# EAGLE design CAN Traffic Teensy 3.2 rev1 (EAGLE 9.6.2)
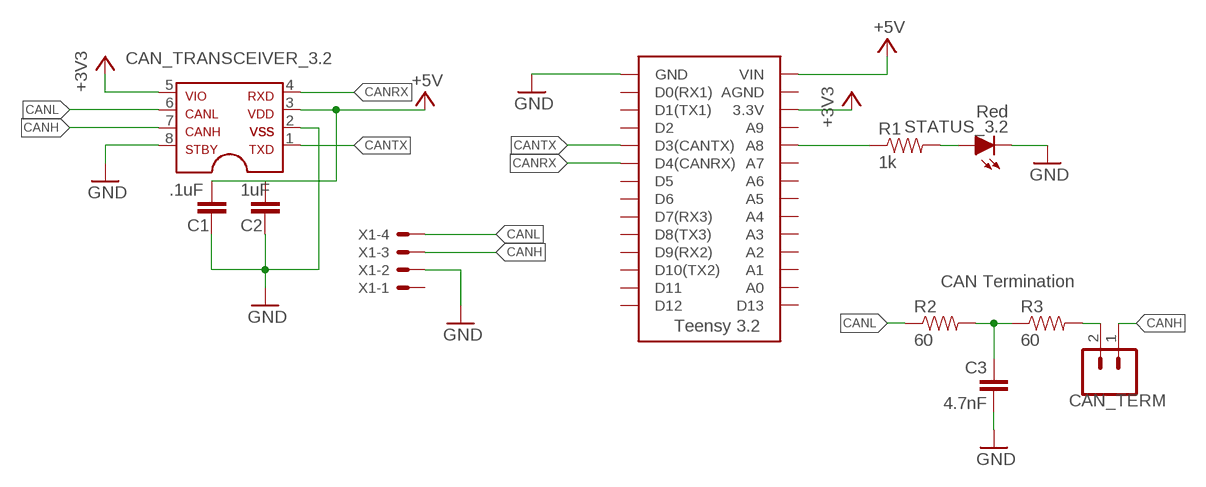
[diagram p0: schematic, sheet 1]

## Parts
3.2  TEENSY_3.2_SIMPLE  [TEENSY_3.2_SIMPLE]
C1  .1uF  CAP0603-CAP  [0603-CAP]
C2  1uF  CAP0603-CAP  [0603-CAP]
C3  4.7nF  CAP0603-CAP  [0603-CAP]
CAN_TERM  M02_SLIM  [1X02_SLIM]
CAN_TRANSCEIVER_3.2  MCP2562FDSOIC-08  [SOIC-08]
R1  1k  RESISTOR0603-RES  [0603-RES]
R2  60  RESISTOR0603-RES  [0603-RES]
R3  60  RESISTOR0603-RES  [0603-RES]
STATUS_3.2  Red  LED-0603  [LED-603]
X1  CONNECTOR-4NANO-FIT_RIGHT_ANGLE-4-SURFACE  [NANO-FIT_RIGHT_ANGLE-4-SURFACE]

## Nets
+3V3: 3.2.3.3V CAN_TRANSCEIVER_3.2.5
+5V: 3.2.VIN C1.1 C2.1 CAN_TRANSCEIVER_3.2.3
CANH: CAN_TERM.1 CAN_TRANSCEIVER_3.2.7 X1.3
CANL: CAN_TRANSCEIVER_3.2.6 R2.1 X1.4
CANRX: 3.2.D4(CANRX) CAN_TRANSCEIVER_3.2.4
CANTX: 3.2.D3(CANTX) CAN_TRANSCEIVER_3.2.1
GND: 3.2.GND C1.2 C2.2 C3.2 CAN_TRANSCEIVER_3.2.2 CAN_TRANSCEIVER_3.2.8 STATUS_3.2.C X1.2
N$2: C3.1 R2.2 R3.1
N$3: 3.2.A8 R1.1
N$4: R1.2 STATUS_3.2.A
N$5: CAN_TERM.2 R3.2
Unconnected: 3.2.A0 3.2.A1 3.2.A2 3.2.A3 3.2.A4 3.2.A5 3.2.A6 3.2.A7 3.2.A9 3.2.AGND 3.2.D0(RX1) 3.2.D1(TX1) 3.2.D2 3.2.D5 3.2.D6 3.2.D7(RX3) 3.2.D8(TX3) 3.2.D9(RX2) 3.2.D10(TX2) 3.2.D11 3.2.D12 3.2.D13 X1.1

## Notes on the sheet
- CAN Termination

## Library data of the parts
3.2 = HyTechDevices:TEENSY_3.2_SIMPLE: Simple version of the Teensy 3.2 board that only uses the 2 main rows of pins, not the inner pins or the pins opposite the usb port.
C1-C3 = HyTechDevices:CAP: Capacitor Standard 0603 ceramic capacitor, and 0.1" leaded capacitor.
CAN_TERM = HyTechDevices:M02: Standard 2-pin 0.1" header. NOTES ON THE VARIANTS LOCK and LOCK_LONGPADS... This footprint was designed to help hold the alignment of a through-hole component (i.e. 6-pin header) while soldering it into place. You may notice that each hole has been shifted either up or down by 0.005 of an inch from it's more standard position (which is a perfectly straight line). This slight alteration caused the pins (the squares in the middle) to touch the edges of the holes. Because they are alternating, it causes a "brace" to hold the component in place. 0.005 has proven to be the perfect amount of "off-center" position when using our standard breakaway headers. Although looks a little odd when you look at the bare footprint, once you have a header in there, the alteration is very hard to notice. Also,if you push a header all the way into place, it is covered up entirely on the bottom side. This idea of altering the position of holes to aid alignment will be further integrated into the Sparkfun Library for other footprints. It can help hold any component with 3 or more connection pins. Note: The Sparkfun version includes many other packages including surface mount that may be of future interest. Source: Sparkfun <https://github.com/sparkfun/SparkFun-Eagle-Libraries>
CAN_TRANSCEIVER_3.2 = HyTechDevices:MCP2562FD: MCP2562FD High-speed CAN Transceiver Datatsheet <http://ww1.microchip.com/downloads/en/devicedoc/20005167c.pdf>
R1-R3 = HyTechDevices:RESISTOR: Resistor Basic schematic elements and footprints for 0603, 1206, and PTH resistors.
STATUS_3.2 = HyTechDevices:LED: Light Emitting Diode (LED) Source: Dangerous Prototypes Eagle Library <https://github.com/DangerousPrototypes/Eagle_Part_Library>
X1 = HyTechDevices:CONNECTOR-4: Mini-Fit Junior connector 4 pole Source: http://www.molex.com

## Board
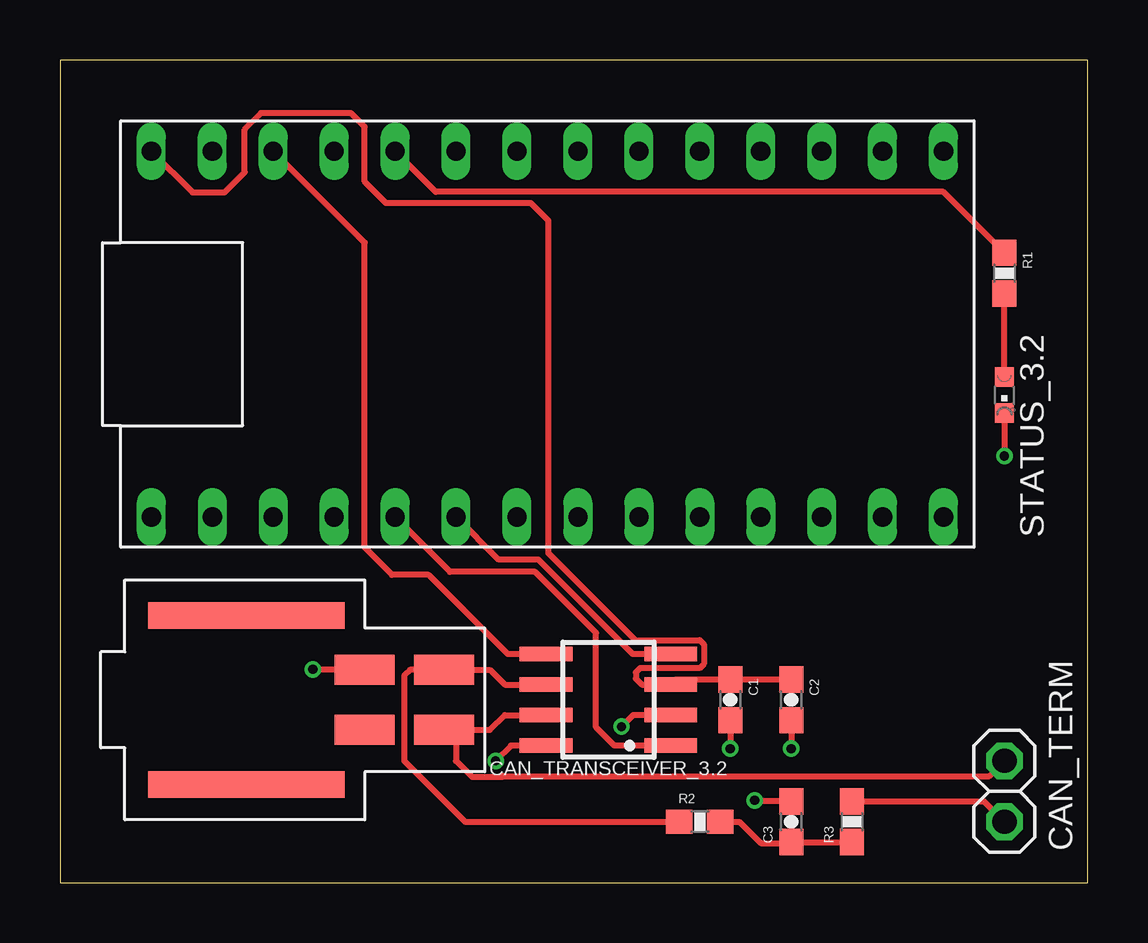
[diagram p1: board, top side]
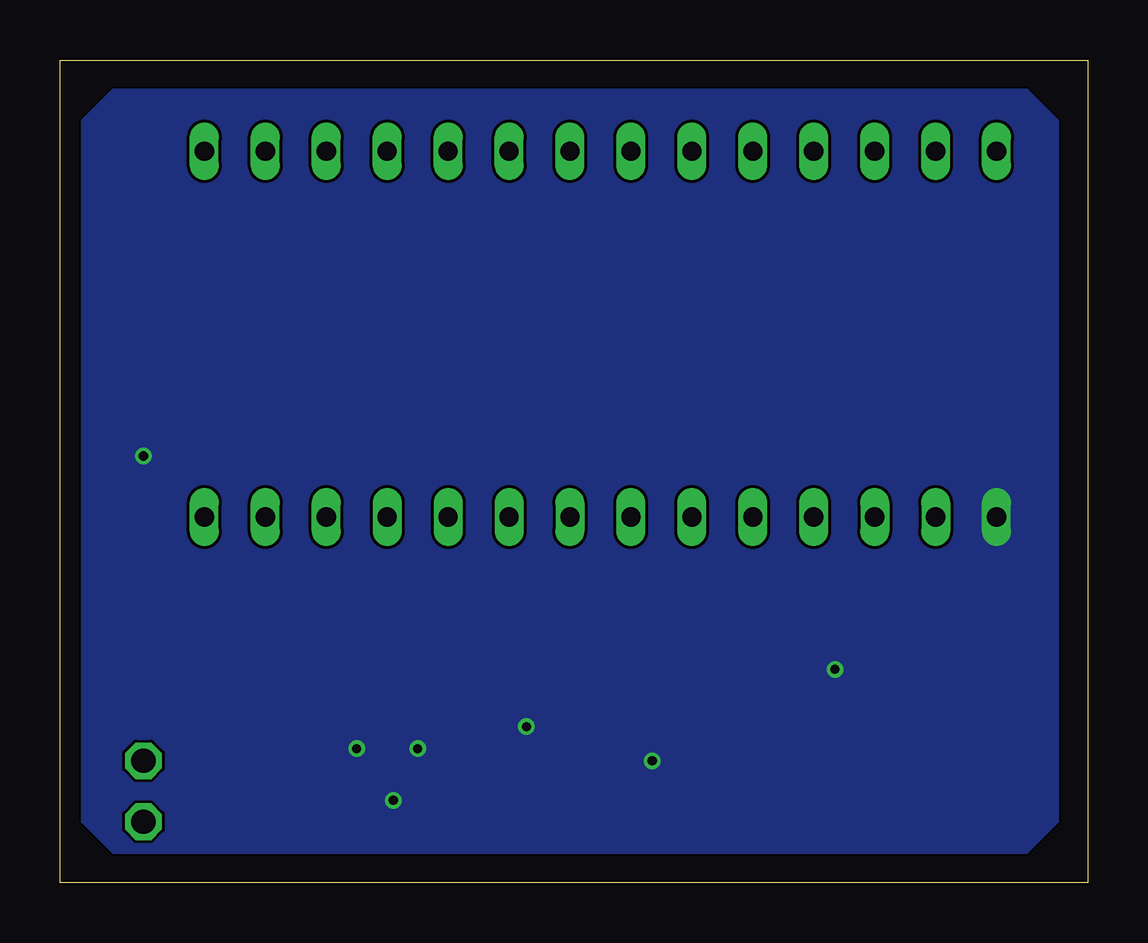
[diagram p2: board, bottom side, seen from below]

Size 42.85 x 34.28 mm. Coordinates in mm from the lower left corner, seen from the top.
Outline: 0,0 42.85,0 42.85,34.28 0,34.28 0,0
Copper layers (1*16): Top 0.035mm / dielectric 1.53mm / Bottom 0.035mm
Design rules "JLCPCB (2 Layer)": minimum track width 5mil, minimum drill 0.3mm, track to track 5mil, track to pad 5mil, pad to pad 5mil, via to via 20mil, smd to smd 5mil, copper to edge 0.2mm, drill to drill 21mil, minimum pad ring 6mil, minimum via ring 6mil, stop-mask expansion 6mil, vias tented up to drill 30mil, thermal gap 10mil

### Footprints (pad centres in the part's own frame; a part is rotated, then mirrored left to right if it is on the bottom)
TEENSY_3.2_SIMPLE = drill 0.8 long: 3.3V 16.51,29.21; A0 16.51,3.81; A1 16.51,6.35; A2 16.51,8.89; A3 16.51,11.43; A4 16.51,13.97; A5 16.51,16.51; A6 16.51,19.05; A7 16.51,21.59; A8 16.51,24.13; A9 16.51,26.67; AGND 16.51,31.75; D0(RX1) 1.27,31.75; D1(TX1) 1.27,29.21; D2 1.27,26.67; D3(CANTX) 1.27,24.13; D4(CANRX) 1.27,21.59; D5 1.27,19.05; D6 1.27,16.51; D7(RX3) 1.27,13.97; D8(TX3) 1.27,11.43; D9(RX2) 1.27,8.89; D10(TX2) 1.27,6.35; D11 1.27,3.81; D12 1.27,1.27; D13 16.51,1.27; GND 1.27,34.29; VIN 16.51,34.29
0603-CAP = smd 1.1 x 1: 1 -0.85,0; 2 0.85,0
1X02_SLIM = drill 1.016 octagon: 1 -1.27,0; 2 1.27,0
SOIC-08 = smd 0.6 x 2.2: 1 -1.905,-2.6; 2 -0.635,-2.6; 3 0.635,-2.6; 4 1.905,-2.6; 5 1.905,2.6; 6 0.635,2.6; 7 -0.635,2.6; 8 -1.905,2.6
0603-RES = smd 1.1 x 1: 1 -0.85,0; 2 0.85,0
LED-603 = smd 0.8 x 0.8: A 0,-0.75; C 0,0.75
NANO-FIT_RIGHT_ANGLE-4-SURFACE = smd 1.24 x 2.5: 1 1.25,0; 2 -1.25,0; 3 1.25,3.3; 4 -1.25,3.3 | smd 1.1 x 8.2: P$5 -3.52,-4.93; P$6 3.52,-4.93

### Placement (x,y rotation side)
3.2  38.1,13.97 90 top
C1  27.94,7.62 270 top
C2  30.48,7.62 270 top
C3  30.48,2.54 90 top
CAN_TERM  39.37,3.81 270 top
CAN_TRANSCEIVER_3.2  22.86,7.62 90 top
R1  39.37,25.4 270 top
R2  26.67,2.54 0 top
R3  33.02,2.54 90 top
STATUS_3.2  39.37,20.32 180 top
X1  12.7,7.62 270 top

### Tracks (layer width: path | path; a pad name or v marks a point on that pad's centre or on a via)
+3V3
  Top 0.254: CAN_TRANSCEIVER_3.2.5 18.67,9.53 15.37,12.83 13.84,12.83 12.7,13.97 12.7,26.67 3.2.3.3V
+5V
  Top 0.254: C2.1 C1.1 25.68,8.47 CAN_TRANSCEIVER_3.2.3 24.26,8.26 24,8.51 24,8.76 24.19,8.95 26.68,8.95 26.84,9.11 26.84,9.94 26.68,10.1 23.99,10.1 20.36,13.73 20.36,27.58 19.63,28.32 13.59,28.32 12.7,29.21 12.7,31.5 12.13,32.07 8.38,32.07 7.7,31.39 7.7,29.61 6.86,28.77 5.52,28.77 3.2.VIN
CANH
  Top 0.254: CAN_TRANSCEIVER_3.2.7 18.54,6.99 17.93,6.37 X1.3 16.51,5.86 16.51,5.08 17.18,4.41 18.44,4.41 18.48,4.45 38.73,4.45 CAN_TERM.1
CANL
  Top 0.254: CAN_TRANSCEIVER_3.2.6 18.54,8.26 17.93,8.87 X1.4 14.59,8.87 14.35,8.64 14.35,5.08 16.89,2.54 R2.1
CANRX
  Top 0.254: CAN_TRANSCEIVER_3.2.4 23.88,9.53 19.94,13.46 18.29,13.46 3.2.D4(CANRX)
CANTX
  Top 0.254: CAN_TRANSCEIVER_3.2.1 23.11,5.71 22.35,6.48 22.35,10.41 19.81,12.95 16.26,12.95 3.2.D3(CANTX)
GND  (via drill 0.38)
  Top 0.254: C1.2 v27.94,5.59 | C2.2 v30.48,5.59 | X1.2 10.56,8.87 v10.54,8.89 | CAN_TRANSCEIVER_3.2.8 18.8,5.71 v18.16,5.08 | CAN_TRANSCEIVER_3.2.2 23.89,6.99 v23.41,6.5 | STATUS_3.2.C v39.37,17.78 | C3.2 29,3.39 v28.96,3.43
  pour Bottom (no thermals): 2.54,1.27 1.27,2.54 1.27,31.75 2.54,33.02 40.64,33.02 41.91,31.75 41.91,2.54 40.64,1.27
N$2
  Top 0.254: R2.2 28.32,2.54 29.21,1.65 30.44,1.65 C3.1 R3.1
N$3
  Top 0.254: R1.1 36.83,28.79 15.66,28.79 3.2.A8
N$4
  Top 0.254: STATUS_3.2.A R1.2
N$5
  Top 0.254: R3.2 38.52,3.39 CAN_TERM.2

### Text on the board
tDocu: TEENSY 3.2